# Altium schematic sheet AtMEGA IC.SchDoc
size A4
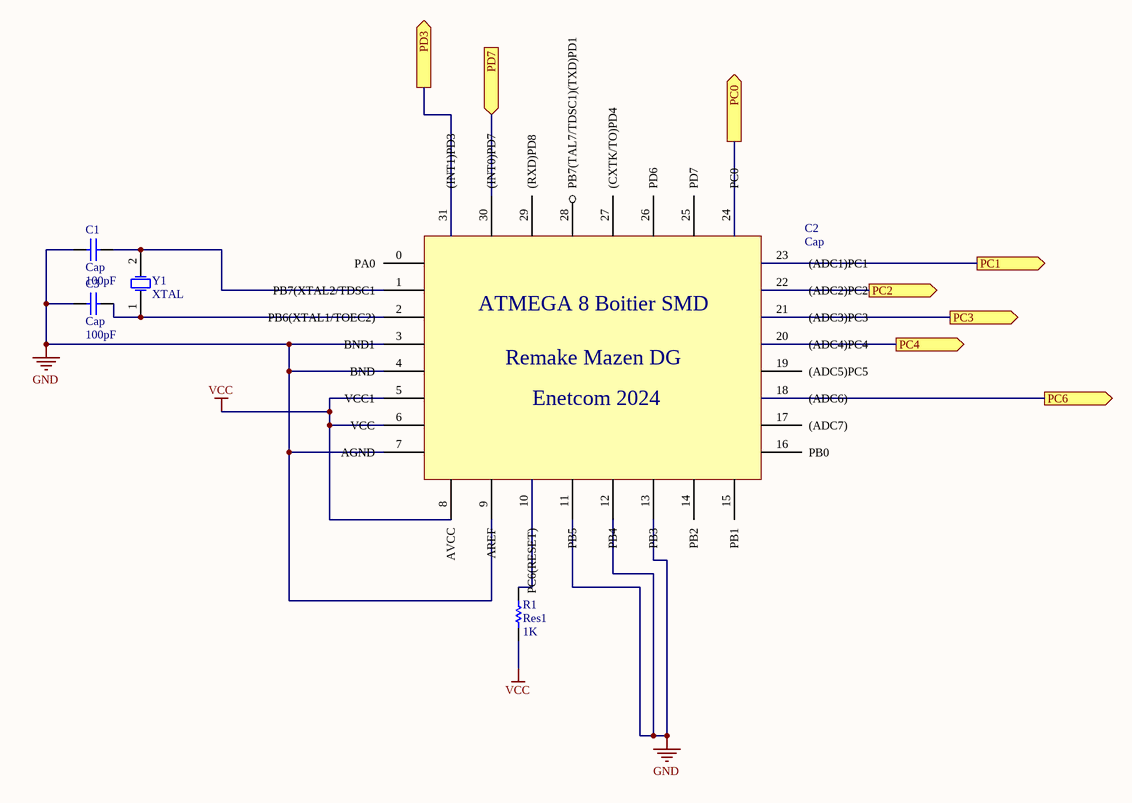
[diagram p0: AtMEGA IC.SchDoc]

## Parts
C1  Cap  value 100pF  [RAD-0.3]
C2  Cap  [Atmega_MAZENKOVIC]
C3  Cap  value 100pF  [RAD-0.3]
R1  Res1  value 1K  [AXIAL-0.3]
Y1  XTAL  [R38]

## Ports
PC0 (out), PC1 (out), PC2 (out), PC3 (out), PC4 (out), PC6 (out), PD3 (out), PD7 (in)

## Nets
GND: C1.1 C3.1
VCC: R1.1
PC0: C2.24(PC0) ; port PC0
PC1: C2.23((ADC1)PC1) ; port PC1
PC2: C2.22((ADC2)PC2) ; port PC2
PC3: C2.21((ADC3)PC3) ; port PC3
PC4: C2.20((ADC4)PC4) ; port PC4
PC6: C2.18((ADC6)) ; port PC6
PD3: C2.31((INT1)PD3) ; port PD3
NetC1_2: C1.2 Y1.2(OSC2)
NetC2_10: C2.10(PC6(RESET)) R1.2
NetC3_2: C3.2 Y1.1(OSC1)

Not connected (* = marked no-connect by the designer): C2 0(PA0) 1(PB7(XTAL2/TDSC1) 2(PB6(XTAL1/TOEC2)) 3(BND1) 4(BND) 5(VCC1) 6(VCC) 7(AGND) 8(AVCC) 9(AREF) 11(PB5) 12(PB4) 13(PB3) 14(PB2) 15(PB1) 16(PB0) 17((ADC7)) 19((ADC5)PC5) 25(PD7) 26(PD6) 27((CXTK/TO)PD4) 28(PB7(TAL7/TDSC1)(TXD)PD1) 29((RXD)PD8) 30((INT0)PD7)

## Notes on the sheet
- (in symbol Component_1) ATMEGA 8 Boitier SMD; Remake Mazen DG; Enetcom 2024

## Library data of the parts
C1 C3 = Cap: Capacitor; Published: 8-Jun-2000; LatestRevisionDate: 17-Jul-2002; LatestRevisionNote: Re-released for DXP Platform.; PackageReference: RAD-0.3; Publisher: Altium Limited; PackageDescription: Radial Cap, Thru-Hole; 2 Leads; 0.3 in Pin Spacing
C2 = Component_1: Capacitor; Published: 4-Mai-2024; LatestRevisionDate: 17-Jul-2002; LatestRevisionNote: Re-released for DXP Platform.; PackageReference: RAD-0.3; Publisher: Altium Limited; PackageDescription: Radial Cap, Thru-Hole; 2 Leads; 0.3 in Pin Spacing
R1 = Res1: Resistor; Published: 8-Jun-2000; LatestRevisionDate: 17-Jul-2002; LatestRevisionNote: Re-released for DXP Platform.; PackageReference: AXIAL-0.3; Publisher: Altium Limited; PackageDescription: Axial Device, Thru-Hole; 2 Leads; 0.3 in Pin Spacing
Y1 = XTAL: Crystal Oscillator; Published: 8-Jun-2000; LatestRevisionDate: 17-Jul-2002; LatestRevisionNote: Re-released for DXP Platform.; PackageReference: R38; Publisher: Altium Limited; PackageDescription: Crystal, Thru-Hole; 2 Leads; Body 3.1 x 8.2 mm (Dia.xH)